# Altium schematic sheet Top.SchDoc
size A3; DocumentNumber: 1; SheetNumber: 1; SheetTotal: 6
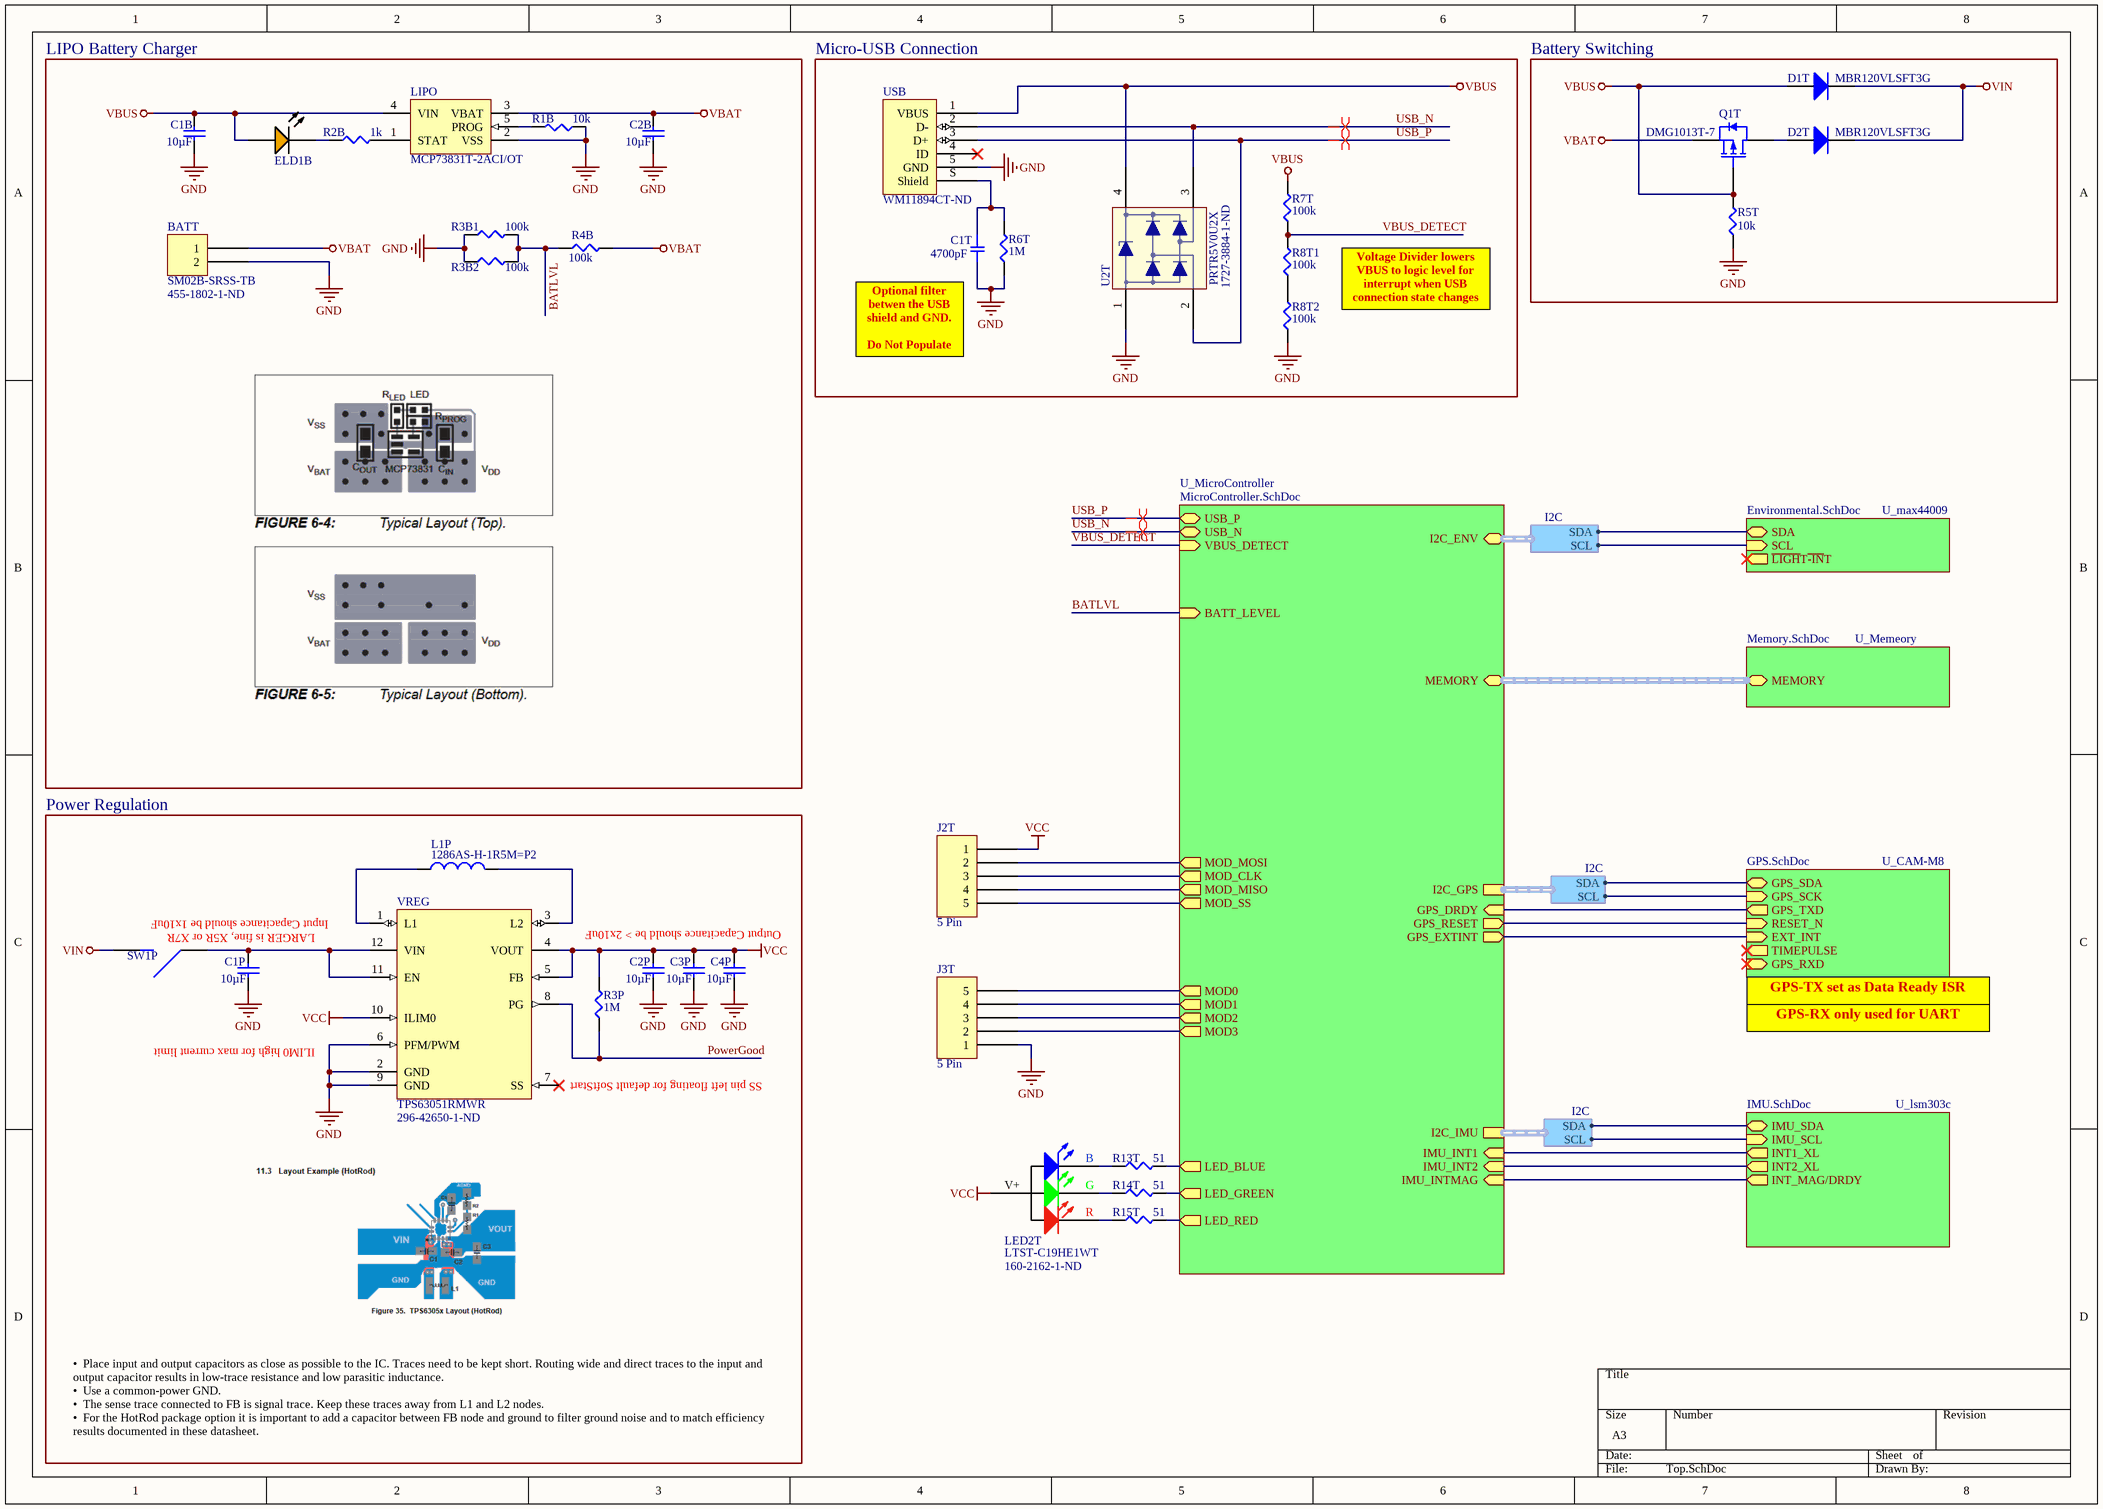
[diagram p0: Top.SchDoc]

## Parts
BATT  SM02B-SRSS-TB  Supplier Part Number 1: 455-1802-1-ND  [JST S2B-PH-SM4]
C1B  Capacitance: 10µF  [C0603N]  (hidden comment: GRT188R61C106KE13D)
C1P  Capacitance: 10µF  [C0603N]  (hidden comment: GRT188R61C106KE13D)
C1T  value 4700pF  [C0603N]  (hidden comment: GCM188R72A472KA37D)
C2B  Capacitance: 10µF  [C0603N]  (hidden comment: GRT188R61C106KE13D)
C2P  Capacitance: 10µF  [C0603N]  (hidden comment: GRT188R61C106KE13D)
C3P  Capacitance: 10µF  [C0603N]  (hidden comment: GRT188R61C106KE13D)
C4P  Capacitance: 10µF  [C0603N]  (hidden comment: GRT188R61C106KE13D)
D1T  MBR120VLSFT3G  [MBR120VLSFT3G]
D2T  MBR120VLSFT3G  [MBR120VLSFT3G]
ELD1B  LTST-C190KFKT  [LED_0603]  (value not drawn)
J2T  5 Pin  [Pinhead_1x5]
J3T  5 Pin  [Pinhead_1x5]
L1P  1286AS-H-1R5M=P2  [L0806_N]
LED2T  LTST-C19HE1WT  Supplier Part Number 1: 160-2162-1-ND  [LED_0606_160X160X35]
LIPO  MCP73831T-2ACI/OT  [SOT-23-5_MC]
Q1T  DMG1013T-7  [SOT50P175X90-3N]
R1B  value 10k  [SMD-0603-RES]  (hidden comment: ERJ-3EKF1002V)
R2B  value 1k  [SMD-0603-RES]  (hidden comment: ERJ-3EKF1001V)
R3B1  value 100k  [SMD-0603-RES]  (hidden comment: ERJ-3EKF1003V)
R3B2  value 100k  [SMD-0603-RES]  (hidden comment: ERJ-3EKF1003V)
R3P  value 1M  [SMD-0603-RES]  (hidden comment: ERJ-3EKF1004V)
R4B  value 100k  [SMD-0603-RES]  (hidden comment: ERJ-3EKF1003V)
R5T  value 10k  [SMD-0603-RES]  (hidden comment: ERJ-3EKF1002V)
R6T  value 1M  [SMD-0603-RES]  (hidden comment: ERJ-3EKF1004V)
R7T  value 100k  [SMD-0603-RES]  (hidden comment: ERJ-3EKF1003V)
R8T1  value 100k  [SMD-0603-RES]  (hidden comment: ERJ-3EKF1003V)
R8T2  value 100k  [SMD-0603-RES]  (hidden comment: ERJ-3EKF1003V)
R13T  value 51  [SMD-0603-RES]  (hidden comment: ERJ-3EKF51R0V)
R14T  value 51  [SMD-0603-RES]  (hidden comment: ERJ-3EKF51R0V)
R15T  value 51  [SMD-0603-RES]  (hidden comment: ERJ-3EKF51R0V)
SW1P  SPST  [Pinhead254_90_1x2]  (value not drawn)
U2T  PRTR5V0U2X  Supplier Part Number 1: 1727-3884-1-ND  [SOT143B]
USB  WM11894CT-ND  [MOLEX_105443-1101]
VREG  TPS63051RMWR  Supplier Part Number 1: 296-42650-1-ND  [QFN12P50_250X250X100]

## Blocks framed on the sheet
LIPO Battery Charger: BATT C1B C2B ELD1B LIPO R1B R2B R3B1 R3B2 R4B
Micro-USB Connection: C1T R6T R7T R8T1 R8T2 U2T USB
Battery Switching: D1T D2T Q1T R5T
Power Regulation: C1P C2P C3P C4P L1P R3P SW1P VREG

## Sub-sheets
U_CAM-M8 = GPS.SchDoc: GPS_SCK (in), GPS_SDA (bidir), EXT_INT (in), TIMEPULSE (out), GPS_RXD (in), GPS_TXD (out), RESET_N (in)
U_lsm303c = IMU.SchDoc: IMU_SCL (in), IMU_SDA (bidir), INT1_XL (out), INT_MAG/DRDY (out), INT2_XL (out)
U_max44009 = Environmental.SchDoc: SDA (bidir), SCL (in), ~{LIGH}T~{-IN}T (out)
U_Memeory = Memory.SchDoc: MEMORY (harness MEMORY)
U_MicroController = MicroController.SchDoc: USB_P (bidir), USB_N (bidir), I2C_GPS (harness I2C), VBUS_DETECT (in), BATT_LEVEL (in), GPS_DRDY (in), GPS_EXTINT (out), I2C_IMU (harness I2C), IMU_INT1 (in), IMU_INT2 (in), IMU_INTMAG (in), I2C_ENV (harness I2C), LED_BLUE (out), LED_GREEN (out), LED_RED (out), MOD3 (out), MOD0 (out), MOD_CLK (out), MOD1 (out), MOD_MOSI (out), MOD_SS (out), MOD2 (out), MOD_MISO (out), GPS_RESET (out), MEMORY (harness MEMORY)

## Harnesses
I2C: SCL, SDA

## Nets
GND: BATT.2 C1B.1 C1P.1 C1T.2 C2B.1 C2P.1 C3P.1 C4P.1 J3T.1 LIPO.2(VSS) R1B.1 R3B1.1 R3B2.1 R5T.1 R6T.1 R8T2.1 U2T.1(GND) USB.5(GND) VREG.2(GND) VREG.6(PFM/PWM) VREG.9(GND)
VBAT: BATT.1 C2B.2 LIPO.3(VBAT) Q1T.2(S) R4B.2
VBUS: C1B.2 D1T.1(A) ELD1B.1(A) LIPO.4(VIN) Q1T.1(G) R5T.2 R7T.2 U2T.4(VCC) USB.1(VBUS)
VCC: C2P.2 C3P.2 C4P.2 J2T.1 LED2T.4(A) R3P.2 VREG.4(VOUT) VREG.5(FB) VREG.10(ILIM0)
VIN: D1T.2(K) D2T.2(K) SW1P.2
BATLVL: R3B1.2 R3B2.2 R4B.1 ; sheet U_MicroController/BATT_LEVEL
PowerGood: R3P.1 VREG.8(PG)
USB_N: U2T.3(I/O2) USB.2(D-) ; sheet U_MicroController/USB_N
USB_P: U2T.2(I/O1) USB.3(D+) ; sheet U_MicroController/USB_P
VBUS_DETECT: R7T.1 R8T1.2 ; sheet U_MicroController/VBUS_DETECT
NetC1P_2: C1P.2 SW1P.1 VREG.11(EN) VREG.12(VIN)
NetC1T_1: C1T.1 R6T.2 USB.S(Shield)
NetD2T_1: D2T.1(A) Q1T.3(D)
NetELD1B_2: ELD1B.2(K) R2B.1
NetJ2T_2: J2T.2 ; sheet U_MicroController/MOD_MOSI
NetJ2T_3: J2T.3 ; sheet U_MicroController/MOD_CLK
NetJ2T_4: J2T.4 ; sheet U_MicroController/MOD_MISO
NetJ2T_5: J2T.5 ; sheet U_MicroController/MOD_SS
NetJ3T_2: J3T.2 ; sheet U_MicroController/MOD3
NetJ3T_3: J3T.3 ; sheet U_MicroController/MOD2
NetJ3T_4: J3T.4 ; sheet U_MicroController/MOD1
NetJ3T_5: J3T.5 ; sheet U_MicroController/MOD0
NetL1P_1: L1P.1 VREG.1(L1)
NetL1P_2: L1P.2 VREG.3(L2)
NetLED2T_1: LED2T.1(R) R15T.1
NetLED2T_2: LED2T.2(G) R14T.1
NetLED2T_3: LED2T.3(B) R13T.1
NetLIPO_1: LIPO.1(STAT) R2B.2
NetLIPO_5: LIPO.5(PROG) R1B.2
NetR8T1_1: R8T1.1 R8T2.2
NetR13T_2: R13T.2 ; sheet U_MicroController/LED_BLUE
NetR14T_2: R14T.2 ; sheet U_MicroController/LED_GREEN
NetR15T_2: R15T.2 ; sheet U_MicroController/LED_RED
(unnamed): sheet U_max44009/SDA, sheet U_MicroController/I2C_ENV.SDA
(unnamed): sheet U_max44009/SCL, sheet U_MicroController/I2C_ENV.SCL
(unnamed): sheet U_CAM-M8/GPS_SCK, sheet U_MicroController/I2C_GPS.SCL
(unnamed): sheet U_CAM-M8/GPS_SDA, sheet U_MicroController/I2C_GPS.SDA
(unnamed): sheet U_CAM-M8/EXT_INT, sheet U_MicroController/GPS_EXTINT
(unnamed): sheet U_CAM-M8/GPS_TXD, sheet U_MicroController/GPS_DRDY
(unnamed): sheet U_CAM-M8/RESET_N, sheet U_MicroController/GPS_RESET
(unnamed): sheet U_lsm303c/IMU_SCL, sheet U_MicroController/I2C_IMU.SCL
(unnamed): sheet U_lsm303c/IMU_SDA, sheet U_MicroController/I2C_IMU.SDA
(unnamed): sheet U_lsm303c/INT1_XL, sheet U_MicroController/IMU_INT1
(unnamed): sheet U_lsm303c/INT_MAG/DRDY, sheet U_MicroController/IMU_INTMAG
(unnamed): sheet U_lsm303c/INT2_XL, sheet U_MicroController/IMU_INT2

Not connected (* = marked no-connect by the designer): USB 4(ID)*; VREG 7(SS)*

## Buses and harness runs
harness sheet U_Memeory/MEMORY = sheet U_MicroController/MEMORY

## Layout directives
differential pair: USB_N, USB_P

## Notes on the sheet
- Voltage Divider lowers VBUS to logic level for interrupt when USB connection state changes
- (near C1T) Optional filter betwen the USB shield and GND.
  Do Not Populate
- Input Capacitance should be 1x10uF
- Output Capacitance should be > 2x10uF
- (near SW1P) LARGER is fine, X5R or X7R
- ILIM0 high for max current limit
- GPS-RX only used for UART
- GPS-TX set as Data Ready ISR
- (near VREG) SS pin left floating for default SoftStart
- •  Place input and output capacitors as close as possible to the IC. Traces need to be kept short. Routing wide and direct traces to the input and output capacitor results in low-trace resistance and low parasitic inductance.
  •  Use a common-power GND.
  •  The sense trace connected to FB is signal trace. Keep these traces away from L1 and L2 nodes.
  •  For the HotRod package option it is important to add a capacitor between FB node and ground to filter ground noise and to match efficiency results documented in these datasheet.
- (in symbol LTST-C19HE1WT) V+

## Library data of the parts
BATT = 2 Pin: Part Number: SM02B-SRSS-TB; Supplier 1: Digi-Key
C1B C1P C2B C2P C3P C4P = CAPACITOR_NP: 10µF 16V Ceramic Capacitor X5R 0603; HOUSEPART: NO; POPULATE: 1; TOLERANCE: ±10%; VOLTAGE: 10V; DeviceName: GRT188R61C106KE13D; LibraryName: MF_Passives; DeviceSetName: CAPACITOR_NP; MPN: GRT188R61C106KE13D; MF_PARTNUM: GRT188R61C106KE13D; Supplier 1: Digi-Key; Supplier Part Number 1: 490-12317-1-ND
C1T = GCM188R72A472KA37D: CAP CER 4700PF 100V X7R 0603; Manufacturer: Murata Electronics North America; Factory Stock: 0; Unit Price (USD): 0.1; Minimum Quantity: 1; Tolerance: ±10%; Datasheets: http://www.murata.com/~/media/webrenewal/support/library/catalog/products/capacitor/mlcc/c03e.ashx; Image: //media.digikey.com/Renders/Murata%20Renders/0603%28GCM188%29.jpg; Digi-Key Part Number: 490-4930-1-ND; Part Number: GCM188R72A472KA37D; Quantity Available: 3550; @ qty: 0; Packaging: Cut Tape (CT); Series: GCM; Part Status: Active; Voltage: 100V; Temperature Coefficient: X7R; Operating Temperature: -55°C ~ 125°C; Features: -; Ratings: AEC-Q200; Applications: Automotive; Mounting Type: Surface Mount, MLCC; Package / Case: 0603 (1608 Metric); Size / Dimension: 0.063" L x 0.031" W (1.60mm x 0.80mm); Height - Seated (Max): -; Thickness (Max): 0.035" (0.90mm); Lead Spacing: -; Lead Style: -; Supplier 1: Digi-Key; Supplier Part Number 1: 490-4930-1-ND
D1T D2T = MBR120VLSFT3G: Diode Schottky 20V 1A Surface Mount SOD-123FL; Manufacturer Part Number: MBR120VLSFT3G; Supplier 1: Digi-Key; Supplier Part Number 1: MBR120VLSFT3GOSCT-ND
ELD1B = CMP-1544850-3: LED Uni-Color Orange, 75 mW, 30 mA; Forward Voltage: 2.00 V; Luminous Intensity: 60.0 mcd; Lens Type: Non-Diffused; Wavelength: 611 nm; Viewing Angle: 130 °; Lead-Free Status: Lead Free; Case/Package (SI): 1608; Size-Width: 800 µm; PackageReference: C190KFKT; Size-Height: 800 µm; Color: Orange; Packaging: Cut Tape (CT), Tape & Reel (TR); RoHS: Compliant; Seller Landing  Url: https://octopart-clicks.com/click/track?country=US&ak=8157f166&sig=0e2a9b5&sid=459&ppid=549896&vpid=1324662&ct=offers; Octopart Url: http://octopart.com/ltst-c190kfkt-lite-on-549896; Mounting Style: Surface Mount, Vertical; OctopartID: 99ca50c8d8a4460d; DatasheetVersion: Rev. I, 09/2011; Manufacturer Part Number: LTST-C190KFKT; Case/Package: 0603; Size-Length: 1.60 mm; PackageDescription: 2-Pin Surface Mount Device, Body 1.6 x 0.8 mm; Supplier 1: Digi-Key; Supplier Part Number 1: 160-1434-1-ND
L1P = INDUCTOR: FIXED IND 1.5UH 2A 114 MOHM SMD; POPULATE: 1; DeviceSetName: INDUCTOR; MPN: 1286AS-H-1R5M=P2
LED2T = LTST-C19HE1WT: RGB LED 0606 (1616 metric); Lead-Free Status: Lead Free; Wavelength - Dominant: 624nm Red, 525nm Green, 470nm Blue; package metric: 1616; Configuration: Common Anode; Octopart URL: http://octopart.com/ltst-c19he1wt-lite-on-13128904; OctopartID: 1946d08468e8c681; RoHS: Compliant; Manufacturer Part Number: LTST-C19HE1WT; package: 0606; Height (Max): 0.45mm; Mounting Type: SMT; Supplier 1: Digi-Key
LIPO = MCHP-MCP73831T-5: MCP73831 Series Single-Cell Li-Ion/Li-Polymer Battery Charge Controller SOT-23-5; Input Voltage (DC): 3.75 V (min); Lead-Free Status: Lead Free; Supply Voltage (DC): 6.00 V (max); Output Voltage: 7.30 V; RoHS: Compliant; Octopart URL: https://octopart-clicks.com/click/track?country=US&ak=8157f166&sig=05342b1&sid=459&ppid=55392281&vpid=188043932&ct=offers; OctopartID: d79a1dddcae5085d; Manufacturer Part Number: MCP73831T-2ACI/OT; REACH SVHC Compliance: No SVHC; Case/Package: SOT-23; Lifecycle Status: Active; Packaging: Cut Tape (CT), Tape & Reel (TR); Number of Pins: 5; Mounting Style: Surface Mount; Octopart Url: http://octopart.com/mcp73831t-2aci%2Fot-microchip-55392281; Supplier 1: Digi-Key; Supplier Part Number 1: MCP73831T-2ACI/OTCT-ND
Q1T = DMG1013T-7c2930a883c7b1d54: P-Channel SOT-523; Lead-Free Status: Lead Free; RoHS: Compliant; Lifecycle Status: Active; Polarity: P-Channel; Manufacturer Part Number: DMG1013T-7; REACH SVHC Compliance: No SVHC; Octopart URL: http://octopart.com/dmg1013t-7-diodes+inc.-17947534; OctopartID: c2930a883c7b1d54; Supplier 1: Digi-Key; Supplier Part Number 1: DMG1013T-7DICT-ND
R1B = ERJ-3EKF1002V: RES SMD 10K OHM 1% 1/10W 0603; Manufacturer: Panasonic Electronic Components; Factory Stock: 0; Unit Price (USD): 0.00379; @ qty: 1500; Minimum Quantity: 1; Power (Watts): 0.1W, 1/10W; Temperature Coefficient: ±100ppm/°C; Part Number: ERJ-3EKF1002V; Datasheets: http://industrial.panasonic.com/www-cgi/jvcr13pz.cgi?E+PZ+3+AOA0002+ERJ3EKF1002V+7+WW; Image: //media.digikey.com/Photos/Panasonic%20Photos/MFG_ERJ-P6W%20Series.jpg; Digi-Key Part Number: P10.0KHCT-ND; Quantity Available: 6703141; Packaging: Cut Tape (CT); Series: ERJ; Part Status: Active; Tolerance: ±1%; Composition: Thick Film; Features: Automotive AEC-Q200; Operating Temperature: -55°C ~ 155°C; Package / Case: 0603 (1608 Metric); Supplier Device Package: 0603; Size / Dimension: 0.063" L x 0.031" W (1.60mm x 0.80mm); Height - Seated (Max): 0.022" (0.55mm); Number of Terminations: 2; Failure Rate: -; Supplier 1: Digi-Key; Supplier Part Number 1: P10.0KHCT-ND
R2B = ERJ-3EKF1001V: RES SMD 1K OHM 1% 1/10W 0603; Manufacturer: Panasonic Electronic Components; Factory Stock: 0; Unit Price (USD): 0.00379; @ qty: 1500; Minimum Quantity: 1; Power (Watts): 0.1W, 1/10W; Temperature Coefficient: ±100ppm/°C; Part Number: ERJ-3EKF1001V; Datasheets: http://industrial.panasonic.com/www-cgi/jvcr13pz.cgi?E+PZ+3+AOA0002+ERJ3EKF1001V+7+WW; Image: //media.digikey.com/Photos/Panasonic%20Photos/MFG_ERJ-P6W%20Series.jpg; Digi-Key Part Number: P1.00KHCT-ND; Quantity Available: 5218845; Packaging: Cut Tape (CT); Series: ERJ; Part Status: Active; Tolerance: ±1%; Composition: Thick Film; Features: Automotive AEC-Q200; Operating Temperature: -55°C ~ 155°C; Package / Case: 0603 (1608 Metric); Supplier Device Package: 0603; Size / Dimension: 0.063" L x 0.031" W (1.60mm x 0.80mm); Height - Seated (Max): 0.022" (0.55mm); Number of Terminations: 2; Failure Rate: -; Supplier 1: Digi-Key; Supplier Part Number 1: P1.00KHCT-ND
R3B1 R3B2 R4B = ERJ-3EKF1003V: RES SMD 100K OHM 1% 1/10W 0603; Manufacturer: Panasonic Electronic Components; MPN: P100KHCT-ND; Factory Stock: 0; Unit Price (USD): 0.00379; @ qty: 1500; Minimum Quantity: 1; Power (Watts): 0.1W, 1/10W; Temperature Coefficient: ±100ppm/°C; Part Number: ERJ-3EKF1003V; Datasheets: http://industrial.panasonic.com/www-cgi/jvcr13pz.cgi?E+PZ+3+AOA0002+ERJ3EKF1003V+7+WW; Image: //media.digikey.com/Photos/Panasonic%20Photos/MFG_ERJ-P6W%20Series.jpg; Digi-Key Part Number: P100KHCT-ND; Quantity Available: 2179804; Packaging: Cut Tape (CT); Series: ERJ; Part Status: Active; Tolerance: ±1%; Composition: Thick Film; Features: Automotive AEC-Q200; Operating Temperature: -55°C ~ 155°C; Package / Case: 0603 (1608 Metric); Supplier Device Package: 0603; Size / Dimension: 0.063" L x 0.031" W (1.60mm x 0.80mm); Height - Seated (Max): 0.022" (0.55mm); Number of Terminations: 2; Failure Rate: -; Supplier 1: Digi-Key; Supplier Part Number 1: P100KHCT-ND
R3P R6T = ERJ-3EKF1004V: RES SMD 1M OHM 1% 1/10W 0603; Manufacturer: Panasonic Electronic Components; Factory Stock: 0; Unit Price (USD): 0.00379; @ qty: 1500; Minimum Quantity: 1; Power (Watts): 0.1W, 1/10W; Temperature Coefficient: ±100ppm/°C; Part Number: ERJ-3EKF1004V; Datasheets: http://industrial.panasonic.com/www-cgi/jvcr13pz.cgi?E+PZ+3+AOA0002+ERJ3EKF1004V+7+WW; Image: //media.digikey.com/Photos/Panasonic%20Photos/MFG_ERJ-P6W%20Series.jpg; Digi-Key Part Number: P1.00MHCT-ND; Quantity Available: 1632074; Packaging: Cut Tape (CT); Series: ERJ; Part Status: Active; Tolerance: ±1%; Composition: Thick Film; Features: Automotive AEC-Q200; Operating Temperature: -55°C ~ 155°C; Package / Case: 0603 (1608 Metric); Supplier Device Package: 0603; Size / Dimension: 0.063" L x 0.031" W (1.60mm x 0.80mm); Height - Seated (Max): 0.022" (0.55mm); Number of Terminations: 2; Failure Rate: -; Supplier 1: Digi-Key; Supplier Part Number 1: P1.00MHCT-ND
R5T = ERJ-3EKF1002V: RES SMD 10K OHM 1% 1/10W 0603; Manufacturer: Panasonic Electronic Components; MPN: P10.0KHCT-ND; Factory Stock: 0; Unit Price (USD): 0.00379; @ qty: 1500; Minimum Quantity: 1; Power (Watts): 0.1W, 1/10W; Temperature Coefficient: ±100ppm/°C; Part Number: ERJ-3EKF1002V; Datasheets: http://industrial.panasonic.com/www-cgi/jvcr13pz.cgi?E+PZ+3+AOA0002+ERJ3EKF1002V+7+WW; Image: //media.digikey.com/Photos/Panasonic%20Photos/MFG_ERJ-P6W%20Series.jpg; Digi-Key Part Number: P10.0KHCT-ND; Quantity Available: 6703141; Packaging: Cut Tape (CT); Series: ERJ; Part Status: Active; Tolerance: ±1%; Composition: Thick Film; Features: Automotive AEC-Q200; Operating Temperature: -55°C ~ 155°C; Package / Case: 0603 (1608 Metric); Supplier Device Package: 0603; Size / Dimension: 0.063" L x 0.031" W (1.60mm x 0.80mm); Height - Seated (Max): 0.022" (0.55mm); Number of Terminations: 2; Failure Rate: -; Supplier 1: Digi-Key; Supplier Part Number 1: P10.0KHCT-ND
R7T R8T1 R8T2 = ERJ-3EKF1003V: RES SMD 100K OHM 1% 1/10W 0603; Manufacturer: Panasonic Electronic Components; Factory Stock: 0; Unit Price (USD): 0.00379; @ qty: 1500; Minimum Quantity: 1; Power (Watts): 0.1W, 1/10W; Temperature Coefficient: ±100ppm/°C; Part Number: ERJ-3EKF1003V; Datasheets: http://industrial.panasonic.com/www-cgi/jvcr13pz.cgi?E+PZ+3+AOA0002+ERJ3EKF1003V+7+WW; Image: //media.digikey.com/Photos/Panasonic%20Photos/MFG_ERJ-P6W%20Series.jpg; Digi-Key Part Number: P100KHCT-ND; Quantity Available: 2179804; Packaging: Cut Tape (CT); Series: ERJ; Part Status: Active; Tolerance: ±1%; Composition: Thick Film; Features: Automotive AEC-Q200; Operating Temperature: -55°C ~ 155°C; Package / Case: 0603 (1608 Metric); Supplier Device Package: 0603; Size / Dimension: 0.063" L x 0.031" W (1.60mm x 0.80mm); Height - Seated (Max): 0.022" (0.55mm); Number of Terminations: 2; Failure Rate: -; Supplier 1: Digi-Key; Supplier Part Number 1: P100KHCT-ND
R13T R14T R15T = ERJ-3EKF51R0V: RES SMD 51 OHM 1% 1/10W 0603; Manufacturer: Panasonic Electronic Components; Factory Stock: 0; Unit Price (USD): 0.00379; @ qty: 1500; Minimum Quantity: 1; Power (Watts): 0.1W, 1/10W; Temperature Coefficient: ±100ppm/°C; Part Number: ERJ-3EKF51R0V; Datasheets: http://industrial.panasonic.com/www-cgi/jvcr13pz.cgi?E+PZ+3+AOA0002+ERJ3EKF51R0V+7+WW; Image: //media.digikey.com/Photos/Panasonic%20Photos/MFG_ERJ-P6W%20Series.jpg; Digi-Key Part Number: P51.0HCT-ND; Quantity Available: 129747; Packaging: Cut Tape (CT); Series: ERJ; Part Status: Active; Tolerance: ±1%; Composition: Thick Film; Features: Automotive AEC-Q200; Operating Temperature: -55°C ~ 155°C; Package / Case: 0603 (1608 Metric); Supplier Device Package: 0603; Size / Dimension: 0.063" L x 0.031" W (1.60mm x 0.80mm); Height - Seated (Max): 0.022" (0.55mm); Number of Terminations: 2; Failure Rate: -; Supplier 1: Digi-Key; Supplier Part Number 1: P51.0HCT-ND
SW1P = SPST switch
U2T = PRTR5V0U2X: C: Copyright (C) 2015 Accelerated Designs. All rights reserved; Vendor: NXP; Built_By: EMA_UL_Team; Value: PRTR5V0U2X; Manufacturer_Part_Number: PRTR5V0U2X; Supplier 1: Digi-Key
USB = USB 2.0 Type B Micro: Supplier 1: Digi-Key; Supplier Part Number 1: WM11894CT-ND
VREG = TPS63051RMWR: Single Inductor Buck Boost Converter 12-VQFN; Manufacturer: Texas Instruments; Current - Output: 500mA; Vin Min: 2.5V; Vin Max: 5.5V; Freqency: 2.5MHz; Package: 12-VFQFN; MPN: TPS63051RMWR; Value: *; Supplier 1: Digi-Key